# Altium project MiniPC.PrjPcb
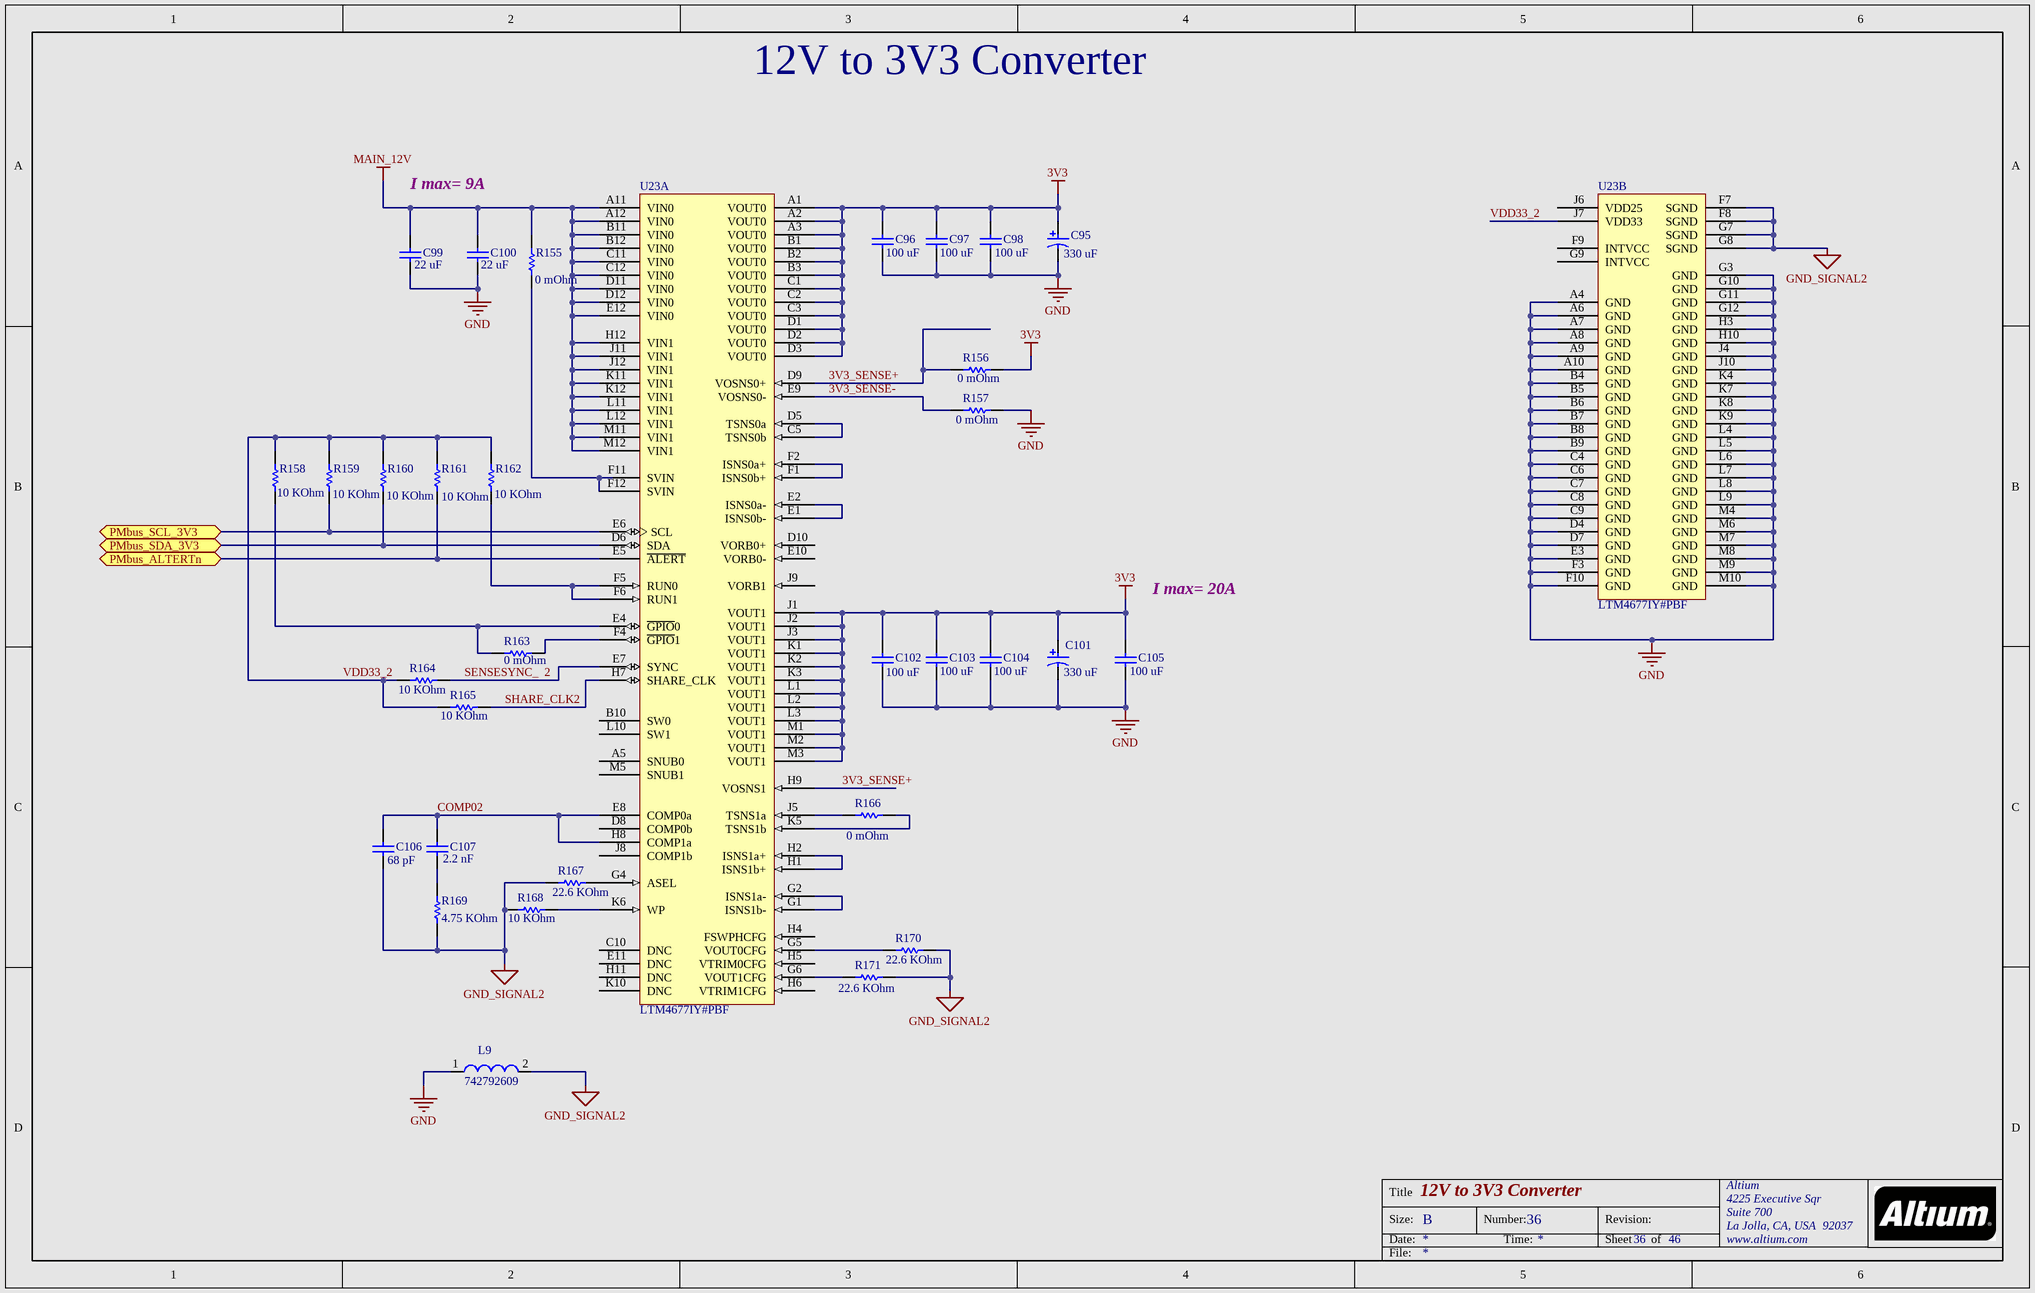
[diagram p0: 12V_to_3V3.SchDoc]
CompanyWebsite: www.altium.com; PrjAddress1: 4225 Executive Sqr; PrjAddress2: Suite 700; PrjAddress3: La Jolla, CA, USA; PrjAddress4: 92037; PrjCompanyName: Altium; Project: Mini PC Motherboard
1 sheet, 32 parts. Net scope: hierarchical (ports join the sheet entries above them; power ports are global).
Board file: MiniPC.PcbDoc

## Sheet 12V_to_3V3.SchDoc: 12V to 3V3 Converter
size B; DocumentNumber: 36; SheetNumber: 36; SheetTotal: 46

### Parts
C95  Capacitance: 330 uF  [PNSC-TPF-D3L_V]  (hidden comment: 6TPF330M9L)
C96  Capacitance: 100 uF  [CAPC3216X190X55ML30T25]  (hidden comment: GRM31CR60J107ME39L)
C97  Capacitance: 100 uF  [CAPC3216X190X55ML30T25]  (hidden comment: GRM31CR60J107ME39L)
C98  Capacitance: 100 uF  [CAPC3216X190X55ML30T25]  (hidden comment: GRM31CR60J107ME39L)
C99  Capacitance: 22 uF  [CAPC3216X180X55ML20T25]  (hidden comment: GRM31CR61E226KE15L)
C100  Capacitance: 22 uF  [CAPC3216X180X55ML20T25]  (hidden comment: GRM31CR61E226KE15L)
C101  Capacitance: 330 uF  [PNSC-TPF-D3L_V]  (hidden comment: 6TPF330M9L)
C102  Capacitance: 100 uF  [CAPC3216X190X55ML30T25]  (hidden comment: GRM31CR60J107ME39L)
C103  Capacitance: 100 uF  [CAPC3216X190X55ML30T25]  (hidden comment: GRM31CR60J107ME39L)
C104  Capacitance: 100 uF  [CAPC3216X190X55ML30T25]  (hidden comment: GRM31CR60J107ME39L)
C105  Capacitance: 100 uF  [CAPC3216X190X55ML30T25]  (hidden comment: GRM31CR60J107ME39L)
C106  Capacitance: 68 pF  [CAPC1005X55X20ML5T10]  (hidden comment: ECJ-0EC1H680J)
C107  Capacitance: 2.2 nF  [CAPC1005X55X10ML05]  (hidden comment: CGJ2B2X7R1E222K050BA)
L9  742792609  [SMD-0603]
R155  Resistance: 0 mOhm  [RESC1005X40X25ML05T05]  (hidden comment: ERJ-2GE0R00X)
R156  Resistance: 0 mOhm  [RESC1005X40X25ML05T05]  (hidden comment: ERJ-2GE0R00X)
R157  Resistance: 0 mOhm  [RESC1005X40X25ML05T05]  (hidden comment: ERJ-2GE0R00X)
R158  Resistance: 10 KOhm  [RESC1005X40X25NL05T05]  (hidden comment: ERJ-2RKF1002X)
R159  Resistance: 10 KOhm  [RESC1005X40X25NL05T05]  (hidden comment: ERJ-2RKF1002X)
R160  Resistance: 10 KOhm  [RESC1005X40X25NL05T05]  (hidden comment: ERJ-2RKF1002X)
R161  Resistance: 10 KOhm  [RESC1005X40X25NL05T05]  (hidden comment: ERJ-2RKF1002X)
R162  Resistance: 10 KOhm  [RESC1005X40X25NL05T05]  (hidden comment: ERJ-2RKF1002X)
R163  Resistance: 0 mOhm  [RESC1005X40X25ML05T05]  (hidden comment: ERJ-2GE0R00X)
R164  Resistance: 10 KOhm  [RESC1005X40X25NL05T05]  (hidden comment: ERJ-2RKF1002X)
R165  Resistance: 10 KOhm  [RESC1005X40X25NL05T05]  (hidden comment: ERJ-2RKF1002X)
R166  Resistance: 0 mOhm  [RESC1005X40X25ML05T05]  (hidden comment: ERJ-2GE0R00X)
R167  Resistance: 22.6 KOhm  [RESC1005X40X25LL05T05]  (hidden comment: CRCW040222K6FKED)
R168  Resistance: 10 KOhm  [RESC1005X40X25NL05T05]  (hidden comment: ERJ-2RKF1002X)
R169  Resistance: 4.75 KOhm  [RESC1005X40X25ML05T05]  (hidden comment: ERJ-2RKF4751X)
R170  Resistance: 22.6 KOhm  [RESC1005X40X25LL05T05]  (hidden comment: CRCW040222K6FKED)
R171  Resistance: 22.6 KOhm  [RESC1005X40X25LL05T05]  (hidden comment: CRCW040222K6FKED)
U23  LTM4677IY#PBF  [LT-BGA-144-05-08-1920_V]  (parts A,B of 2)

### Ports
PMbus_ALTERTn (bidir), PMbus_SCL_3V3 (bidir), PMbus_SDA_3V3 (bidir)

### Nets
3V3: C95.1 C96.2 C97.2 C98.2 C101.1 C102.2 C103.2 C104.2 C105.2 R156.2 U23.A1(VOUT0) U23.A2(VOUT0) U23.A3(VOUT0) U23.B1(VOUT0) U23.B2(VOUT0) U23.B3(VOUT0) U23.C1(VOUT0) U23.C2(VOUT0) U23.C3(VOUT0) U23.D1(VOUT0) U23.D2(VOUT0) U23.D3(VOUT0) U23.J1(VOUT1) U23.J2(VOUT1) U23.J3(VOUT1) U23.K1(VOUT1) U23.K2(VOUT1) U23.K3(VOUT1) U23.L1(VOUT1) U23.L2(VOUT1) U23.L3(VOUT1) U23.M1(VOUT1) U23.M2(VOUT1) U23.M3(VOUT1)
GND: C95.2 C96.1 C97.1 C98.1 C99.1 C100.1 C101.2 C102.1 C103.1 C104.1 C105.1 L9.1 R157.2 U23.A4(GND) U23.A6(GND) U23.A7(GND) U23.A8(GND) U23.A9(GND) U23.A10(GND) U23.B4(GND) U23.B5(GND) U23.B6(GND) U23.B7(GND) U23.B8(GND) U23.B9(GND) U23.C4(GND) U23.C6(GND) U23.C7(GND) U23.C8(GND) U23.C9(GND) U23.D4(GND) U23.D7(GND) U23.E3(GND) U23.F3(GND) U23.F10(GND) U23.G3(GND) U23.G10(GND) U23.G11(GND) U23.G12(GND) U23.H3(GND) U23.H10(GND) U23.J4(GND) U23.J10(GND) U23.K4(GND) U23.K7(GND) U23.K8(GND) U23.K9(GND) U23.L4(GND) U23.L5(GND) U23.L6(GND) U23.L7(GND) U23.L8(GND) U23.L9(GND) U23.M4(GND) U23.M6(GND) U23.M7(GND) U23.M8(GND) U23.M9(GND) U23.M10(GND)
GND_SIGNAL2: C106.1 L9.2 R167.1 R168.2 R169.1 R170.2 R171.2 U23.F7(SGND) U23.F8(SGND) U23.G7(SGND) U23.G8(SGND)
MAIN_12V: C99.2 C100.2 R155.2 U23.A11(VIN0) U23.A12(VIN0) U23.B11(VIN0) U23.B12(VIN0) U23.C11(VIN0) U23.C12(VIN0) U23.D11(VIN0) U23.D12(VIN0) U23.E12(VIN0) U23.H12(VIN1) U23.J11(VIN1) U23.J12(VIN1) U23.K11(VIN1) U23.K12(VIN1) U23.L11(VIN1) U23.L12(VIN1) U23.M11(VIN1) U23.M12(VIN1)
3V3_SENSE+: R156.1 U23.D9(VOSNS0+) U23.H9(VOSNS1)
3V3_SENSE-: R157.1 U23.E9(VOSNS0-)
COMP02: C106.2 C107.2 U23.E8(COMP0a) U23.H8(COMP1a)
PMbus_ALTERTn: R161.1 U23.E5(~{ALERT}) ; port PMbus_ALTERTn
PMbus_SCL_3V3: R159.1 U23.E6(SCL) ; port PMbus_SCL_3V3
PMbus_SDA_3V3: R160.1 U23.D6(SDA) ; port PMbus_SDA_3V3
SENSESYNC_  2: R164.1 U23.E7(SYNC)
SHARE_CLK2: R165.1 U23.H7(SHARE_CLK)
VDD33_2: R158.2 R159.2 R160.2 R161.2 R162.2 R164.2 R165.2 U23.J7(VDD33)
NetC107_1: C107.1 R169.2
NetR155_1: R155.1 U23.F11(SVIN) U23.F12(SVIN)
NetR158_1: R158.1 R163.2 U23.E4(~{GPIO}0)
NetR162_1: R162.1 U23.F5(RUN0) U23.F6(RUN1)
NetR163_1: R163.1 U23.F4(~{GPIO}1)
NetR166_1: R166.1 U23.J5(TSNS1a)
NetR166_2: R166.2 U23.K5(TSNS1b)
NetR167_2: R167.2 U23.G4(ASEL)
NetR168_1: R168.1 U23.K6(WP)
NetR170_1: R170.1 U23.G5(VOUT0CFG)
NetR171_1: R171.1 U23.G6(VOUT1CFG)
NetU23_C5: U23.C5(TSNS0b) U23.D5(TSNS0a)
NetU23_E1: U23.E1(ISNS0b-) U23.E2(ISNS0a-)
NetU23_F1: U23.F1(ISNS0b+) U23.F2(ISNS0a+)
NetU23_G1: U23.G1(ISNS1b-) U23.G2(ISNS1a-)
NetU23_H1: U23.H1(ISNS1b+) U23.H2(ISNS1a+)

Not connected (* = marked no-connect by the designer): U23 A5(SNUB0) B10(SW0) C10(DNC) D8(COMP0b) D10(VORB0+) E10(VORB0-) E11(DNC) F9(INTVCC) G9(INTVCC) H4(FSWPHCFG) H5(VTRIM0CFG) H6(VTRIM1CFG) H11(DNC) J6(VDD25) J8(COMP1b) J9(VORB1) K10(DNC) L10(SW1) M5(SNUB1)

### Notes on the sheet
- I max= 9A
- I max= 20A
- Title
- Size:
- Date:
- B
- Number:
- Time:
- Revision:
- Sheet
- of
- File:

### Library data of the parts
C95 C101 = CMP-1665-00019-2: Tantalum Capacitor, 330 uF, +/- 20%, 6.3 V, -55 to 105 degC, 2-Pin Molded, RoHS, Tape and Reel; ComponentLink2Description: Datasheet; Radiation Hardening: No; ComponentLink1URL: http://www.panasonic.com/; Min Operating Temperature: -55 degC; Mounting Technology: Surface Mount; Mount: Surface Mount; ComponentLink2URL: http://industrial.panasonic.com/cdbs/www-data/pdf/AAA8000/AAA8000C38.pdf; Case/Package: 2917; ComponentLink3Description: Package Specification; PackageDescription: 2-Pin Molded Capacitor, Body 7.3 x 4.3 mm; Width: 0.169 inch; DatasheetVersion: 11/2015; Length: 0.287 inch; ComponentLink3URL: http://industrial.panasonic.com/cdbs/www-data/pdf/AAA8000/AAA8000COL34.pdf; Height: 2.8 mm; RoHSCompliant: True; ComponentLink1Description: Manufacturer URL; REACH SVHC: Unknown; Package Quantity: 2500; Max Operating Temperature: 105 degC; Packaging: Tape and Reel; PartNumber: 6TPF330M9L
C96-C98 C102-C105 = CMP-1662-00011-2: Chip Capacitor, 100 uF, +/- 20%, 6.3 V, -55 to 85 degC, 1206 (3216 Metric), RoHS, Tape and Reel; Voltage Rating: 6.3 V; Type (Capacitors): X5R; Case\/Package: 1206; Tolerance: 20%; ComponentLink1URL: http://www.murata.com/; ComponentLink1Description: Manufacturer URL; PackageDescription: 2-Pin Surface Mount Device, Body 3.2 x 1.6 mm; Max Operating Temperature: 85 degC; Case Code (Imperial): 1206; PackageReference: 1206; Height: 1.6 mm; Width: 1.6 mm; Packaging: Tape and Reel; DatasheetVersion: 09/2016; REACH SVHC: No SVHC; Mounting Technology: Surface Mount; Case Code (Metric): 3216; Min Operating Temperature: -55 degC; RoHSCompliant: true; Radiation Hardening: No; Voltage Rating (DC): 6.3 V; Package Quantity: 2000; ComponentLink2Description: Datasheet; Mount: Surface Mount; Length: 3.2 mm; ComponentLink2URL: http://psearch.en.murata.com/capacitor/product/GRM31CR60J107ME39%23.pdf; Pins: 2; PartNumber: GRM31CR60J107ME39L
C99 C100 = CMP-1662-00010-2: Chip Capacitor, 22 uF, +/- 10%, 25 V, -55 to 85 degC, 1206 (3216 Metric), RoHS, Tape and Reel; Voltage Rating (DC): 25 V; Case\/Package: 1206; Type (Capacitors): X5R; Tolerance: 10%; Max Operating Temperature: 85 degC; Package Quantity: 2000; Voltage Rating: 25 V; Case Code (Metric): 3216; Length: 3.2 mm; PackageDescription: 2-Pin Surface Mount Device, Body 3.2 x 1.6 mm; ComponentLink1Description: Manufacturer URL; Case Code (Imperial): 1206; ComponentLink1URL: http://www.murata.com/; Radiation Hardening: No; Height: 1.6 mm; Width: 1.6 mm; DatasheetVersion: 03/2016; Min Operating Temperature: -55 degC; Mount: Surface Mount; REACH SVHC: No SVHC; PackageReference: 1206; ComponentLink2URL: http://search.murata.co.jp/Ceramy/image/img/A01X/G101/ENG/GRM31CR61E226KE15-01.pdf; Packaging: Tape and Reel; RoHSCompliant: true; ComponentLink2Description: Datasheet; Mounting Technology: Surface Mount; PartNumber: GRM31CR61E226KE15L; Pins: 2
C106 = CMP-1665-00023-1: Chip Capacitor, 68 pF, +/- 5%, 50 V, -55 to 125 degC, 0402 (1005 Metric), RoHS, Tape and Reel; Type (Capacitors): C0G; Voltage Rating: 50 V; Case\/Package: 0402; Tolerance: 5%; ComponentLink2URL: http://media.digikey.com/pdf/Data%20Sheets/Panasonic%20Capacitors%20PDFs/ECJ_(General).pdf; RoHSCompliant: true; ComponentLink1Description: Manufacturer URL; Mount: Surface Mount; Height: 0.5 mm; Length: 0.039 inch; Width: 0.02 inch; ComponentLink1URL: http://www.panasonic.com/; Max Operating Temperature: 125 degC; Packaging: Cut Tape; PackageReference: 0402; Case Code (Metric): 1005; Min Operating Temperature: -55 degC; Package Quantity: 1; ComponentLink2Description: Datasheet; Mounting Technology: Surface Mount; Case Code (Imperial): 0402; DatasheetVersion: 09/2008; PackageDescription: 2-Pin Surface Mount Device, Body 1 x 0.5 mm
C107 = CMP-1663-00010-2: Chip Capacitor, 2.2 nF, +/- 10%, 25 V, -55 to 125 degC, 0402 (1005 Metric), RoHS, Tape and Reel; Voltage Rating (DC): 25 V; Type (Capacitors): X7R; Case\/Package: 0402; Tolerance: 10%; Case Code (Imperial): 0402; ComponentLink1URL: http://www.tdk.com/; Radiation Hardening: No; RoHSCompliant: true; Max Operating Temperature: 125 degC; ComponentLink2URL: https://product.tdk.com/info/en/documents/chara_sheet/CGJ2B2X7R1E222K050BA.pdf; Mounting Technology: Surface Mount; Package Quantity: 1; PackageDescription: 2-Pin Surface Mount Device, Body 1 x 0.5 mm; Min Operating Temperature: -55 degC; Voltage Rating: 25 V; Height: 0.5 mm; PackageReference: 0402; Case Code (Metric): 1005; DatasheetVersion: 01/2016; Mount: Surface Mount; Width: 0.5 mm; ComponentLink1Description: Manufacturer URL; Length: 1 mm; ComponentLink2Description: Datasheet; Packaging: Tape and Reel; PartNumber: CGJ2B2X7R1E222K050BA; Pins: 2
L9 = CMP-0220-00193-1: SMD EMI Suppression Ferrite Bead WE-CBF, Z = 30 Ohm; Impedance: 30 Ohm; ComponentLink2URL: http://www.we-online.de/katalog/media/pdf/742792609.pdf; ComponentLink1URL: http://www.we-online.com; ComponentLink2Description: Datasheet; PackageDescription: Chip Inductor, 2-Leads, Body 1.6 x 0.8 mm; ComponentLink1Description: Manufacturer Link; PackageReference: SMD-0603; DatasheetVersion: Dec-2005; PackageVersion: 2009
R155-R157 R163 R166 = CMP-2002-00429-3: Chip Resistor, 0 mOhm, +/- 5%, 100 mW, -55 to 155 degC, 0402 (1005 Metric), RoHS, Tape and Reel; Manufacturer: Basic Passives; Power Rating: 100 mW; Voltage Rating: 50 V; Case\/Package: 0402; Max Operating Temperature: 155 degC; Tolerance: 5%; PartNumber: ERJ-2GE0R00X; Case Code (Imperial): 0402; Package Quantity: 10000; Length: 1 mm; Mounting Technology: Surface Mount; ComponentLink1URL: http://www.panasonic.com/; Height: 0.35 mm; Width: 0.5 mm; Min Operating Temperature: -55 degC; Case Code (Metric): 1005; RoHSCompliant: true; REACH SVHC: Unknown; ComponentLink1Description: Manufacturer URL; Packaging: Tape and Reel; Mount: Surface Mount; PackageDescription: 2-Pin Surface Mount Device, Body 1 x 0.5 mm; PackageReference: 0402; ComponentLink2URL: http://industrial.panasonic.com/cdbs/www-data/pdf/RDA0000/AOA0000C84.pdf; DatasheetVersion: 03/2015; Radiation Hardening: No; Pins: 2; ComponentLink2Description: Datasheet
R158-R162 R164 R165 R168 = CMP-2002-00607-3: Chip Resistor, 10 KOhm, +/- 1%, 100 mW, -55 to 155 degC, 0402 (1005 Metric), RoHS, Tape and Reel; Manufacturer: Basic Passives; Voltage Rating: 50 V; Power Rating: 100 mW; Case\/Package: 0402; Case Code (Imperial): 0402; Min Operating Temperature: -55 degC; PartNumber: ERJ-2RKF1002X; Mounting Technology: Surface Mount; Length: 1 mm; Packaging: Tape and Reel; ComponentLink1Description: Manufacturer URL; Mount: Surface Mount; Package Quantity: 10000; Max Operating Temperature: 155 degC; Case Code (Metric): 1005; Height: 0.35 mm; ComponentLink1URL: http://www.panasonic.com/; Tolerance: 1%; REACH SVHC: Yes; RoHSCompliant: true; Width: 0.5 mm; PackageDescription: 2-Pin Surface Mount Device, Body 1 x 0.5 mm; Radiation Hardening: No; PackageReference: 0402; ComponentLink2Description: Datasheet; DatasheetVersion: 04/2015; ComponentLink2URL: http://industrial.panasonic.com/cdbs/www-data/pdf/RDA0000/AOA0000C86.pdf; Pins: 2
R167 R170 R171 = CMP-2002-08381-2: Chip Resistor, 22.6 KOhm, +/- 1%, 63 mW, -55 to 155 degC, 0402 (1005 Metric), RoHS, Tape and Reel; Voltage Rating: 50 V; Power Rating: 63 mW; RoHSCompliant: True; Width: 0.5 mm; ComponentLink1URL: http://www.vishay.com/docs/20035/dcrcwe3.pdf; Case Code (Metric): 1005; Package Quantity: 10000; PartNumber: CRCW040222K6FKED; Mounting Technology: Surface Mount; REACH SVHC: Unknown; ComponentLink1Description: Datasheet; Height: 0.35 mm; Mount: Surface Mount; PackageDescription: 2-Pin Surface Mount Device, Body 1 x 0.5 mm; Min Operating Temperature: -55 degC; Case Code (Imperial): 0402; Packaging: Tape and Reel; Length: 1 mm; Max Operating Temperature: 155 degC; Tolerance: 1%; Case/Package: 0402
R169 = CMP-2002-00956-3: Chip Resistor, 4.75 KOhm, +/- 1%, 100 mW, -55 to 155 degC, 0402 (1005 Metric), RoHS, Tape and Reel; Manufacturer: Basic Passives; Power Rating: 100 mW; Voltage Rating: 50 V; Case\/Package: 0402; Min Operating Temperature: -55 degC; RoHSCompliant: true; Package Quantity: 10000; Packaging: Tape and Reel; Mounting Technology: Surface Mount; REACH SVHC: Yes; Height: 0.35 mm; Mount: Surface Mount; PackageDescription: 2-Pin Surface Mount Device, Body 1 x 0.5 mm; Case Code (Metric): 1005; Max Operating Temperature: 155 degC; Case Code (Imperial): 0402; Length: 1 mm; ComponentLink1Description: Manufacturer URL; Tolerance: 1%; PartNumber: ERJ-2RKF4751X; ComponentLink1URL: http://www.panasonic.com/; Width: 0.5 mm; PackageReference: 0402; Pins: 2; ComponentLink2Description: Datasheet; DatasheetVersion: 04/2015; ComponentLink2URL: http://industrial.panasonic.com/cdbs/www-data/pdf/RDA0000/AOA0000C86.pdf; Radiation Hardening: No
U23 = CMP-1701-00001-1: Dual 18 A or Single 36 A uModule Regulator with Digital Power System Management, 4.5 to 16 V Input, 0.5 to 1.8 V Output, -40 to 125 degC, 144-Ball BGA, RoHS, Tray; Manufacturer: Linear Technology; ComponentLink1Description: Manufacturer URL; PartNumber: LTM4677IY#PBF; PackageVersion: Rev. B, 02/2013; ComponentLink3URL: http://www.linear.com/docs/41077; ComponentLink2URL: http://cds.linear.com/docs/en/datasheet/4677f.pdf; ComponentLink1URL: http://www.linear.com/; Mounting Technology: Surface Mount; ComponentLink2Description: Datasheet; PackageReference: BGA-144; PackageDescription: 144-Ball Ball Grid Array, Body 16 x 16 mm, Pitch 1.27 mm; ComponentLink3Description: Package Specification; DatasheetVersion: Rev. F; PartId: 1